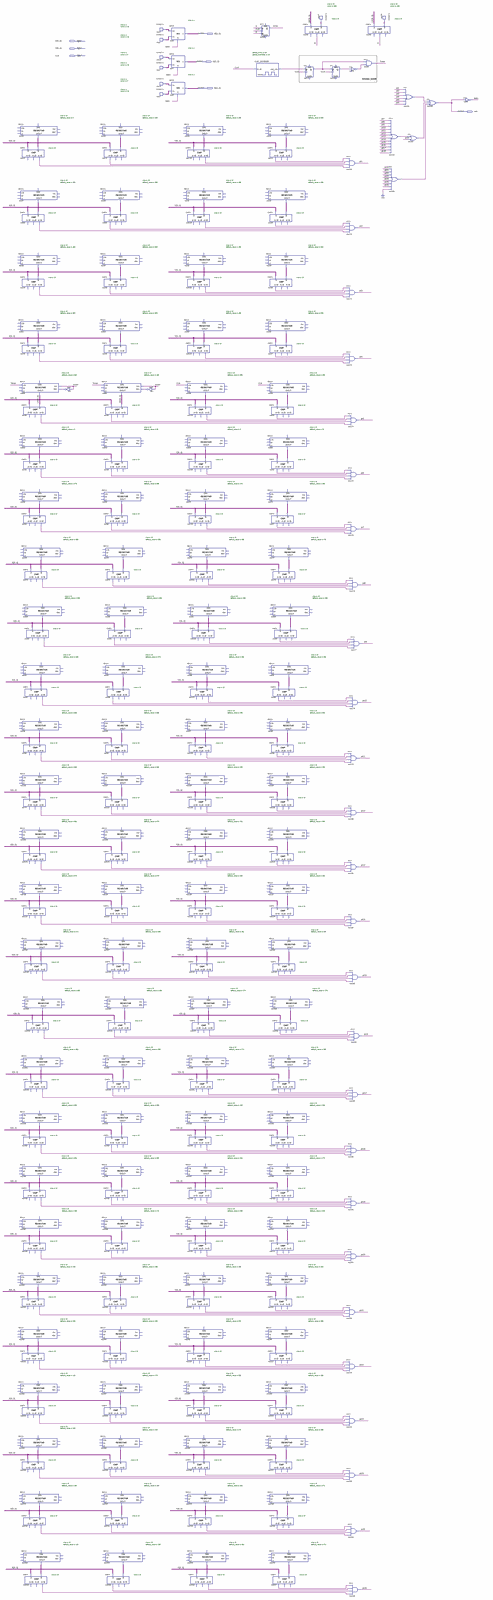
[diagram p0: schematic sheet, whole]
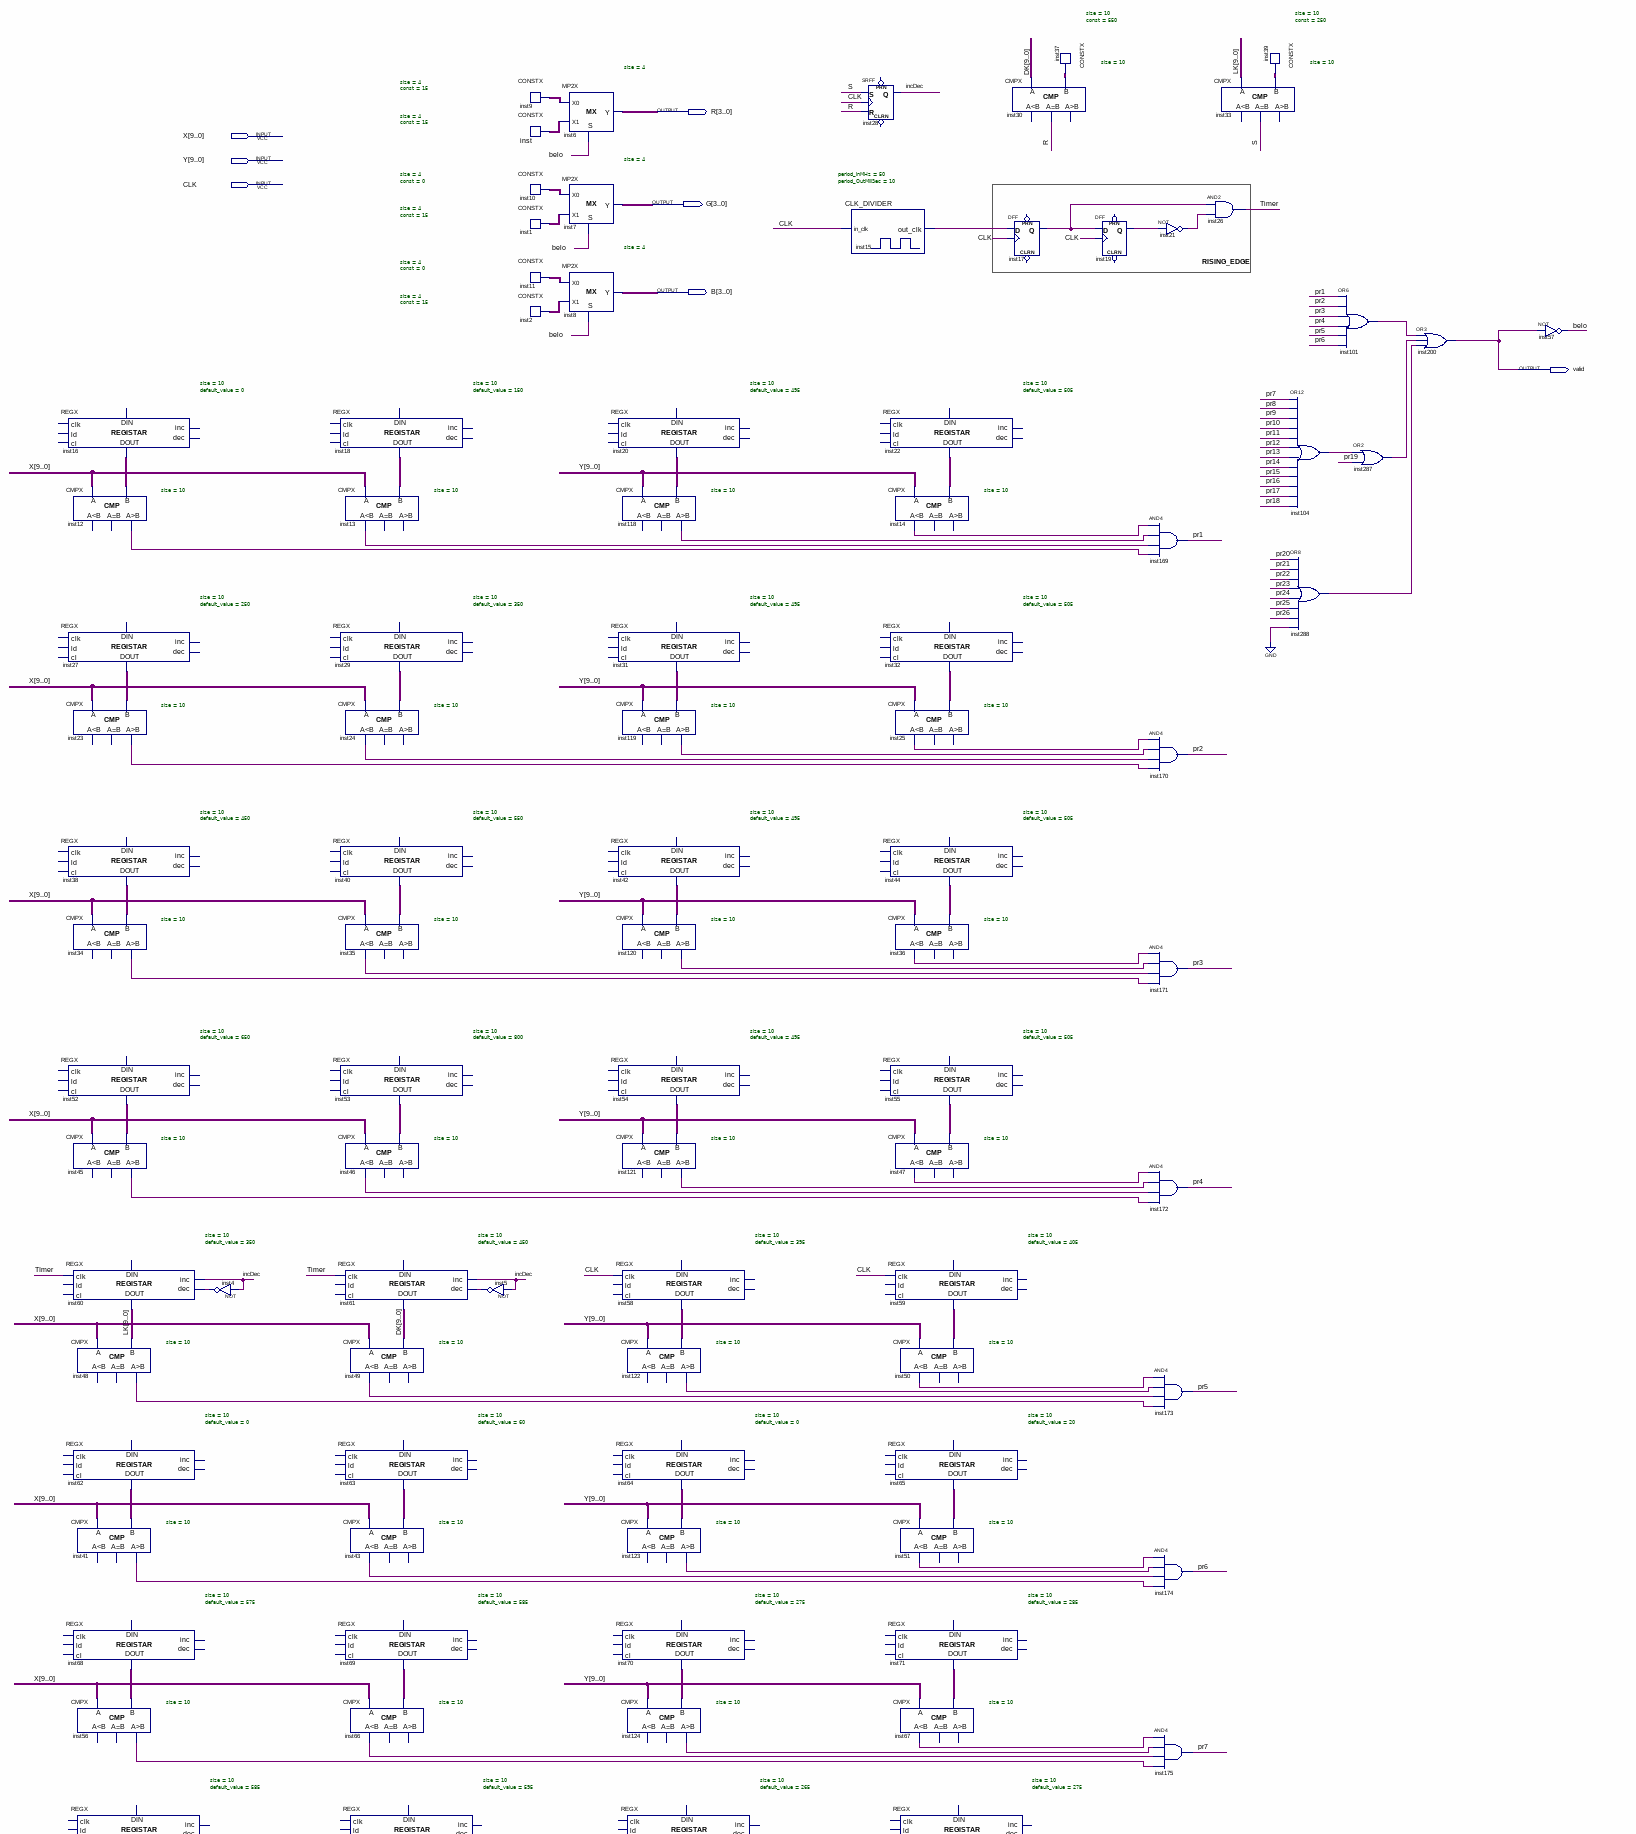
[diagram p1: schematic sheet, upper part]
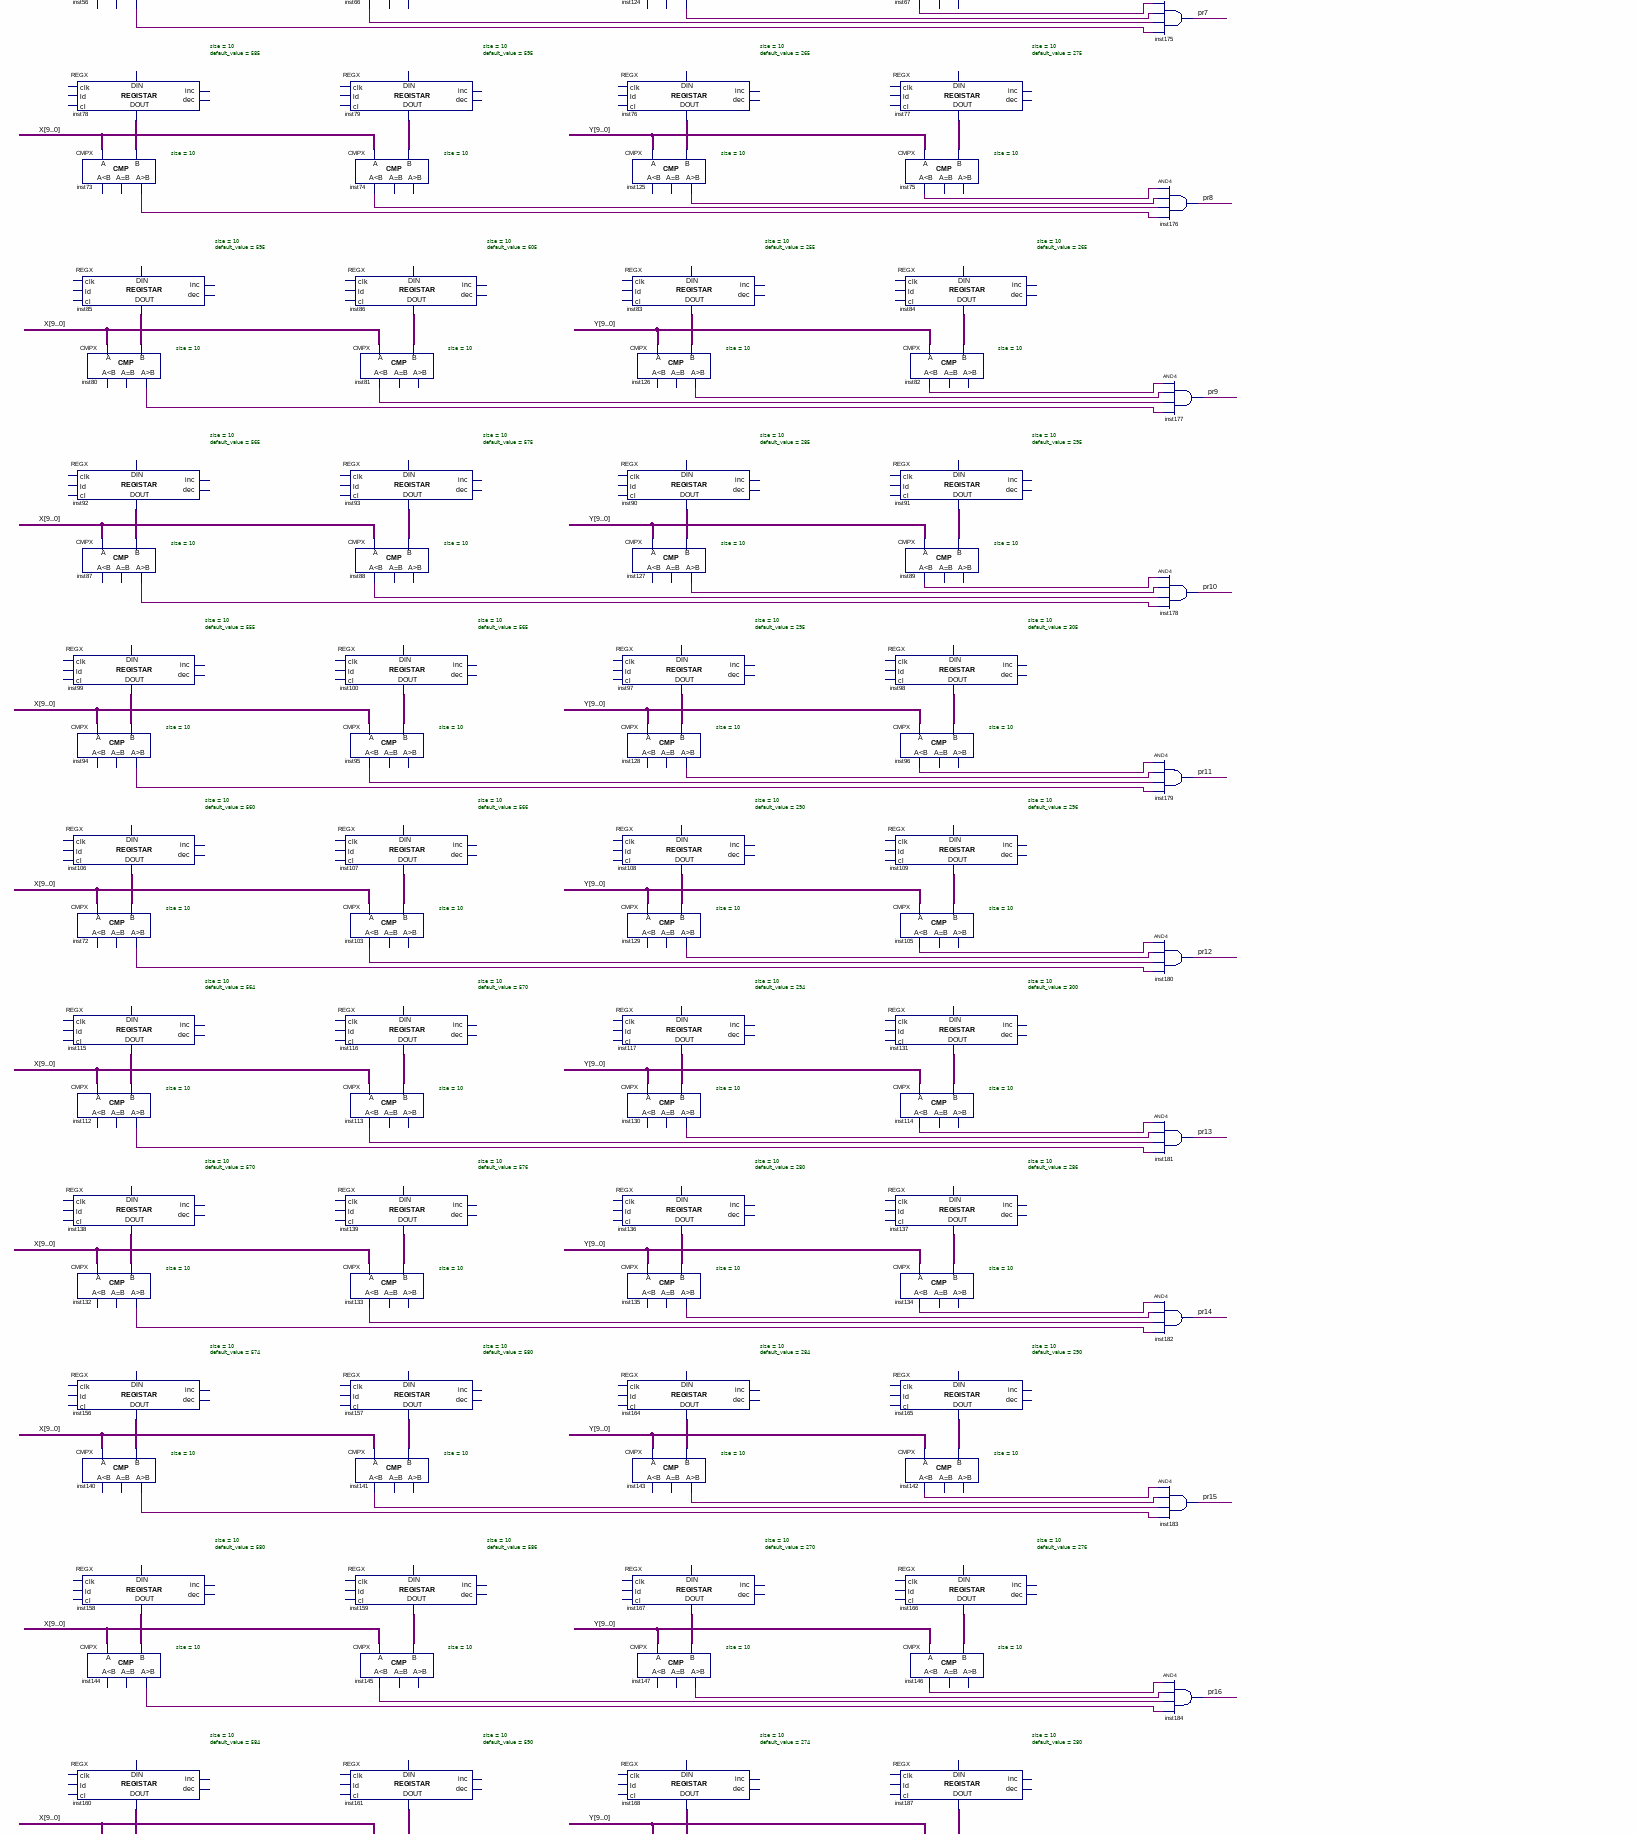
[diagram p2: schematic sheet, middle part]
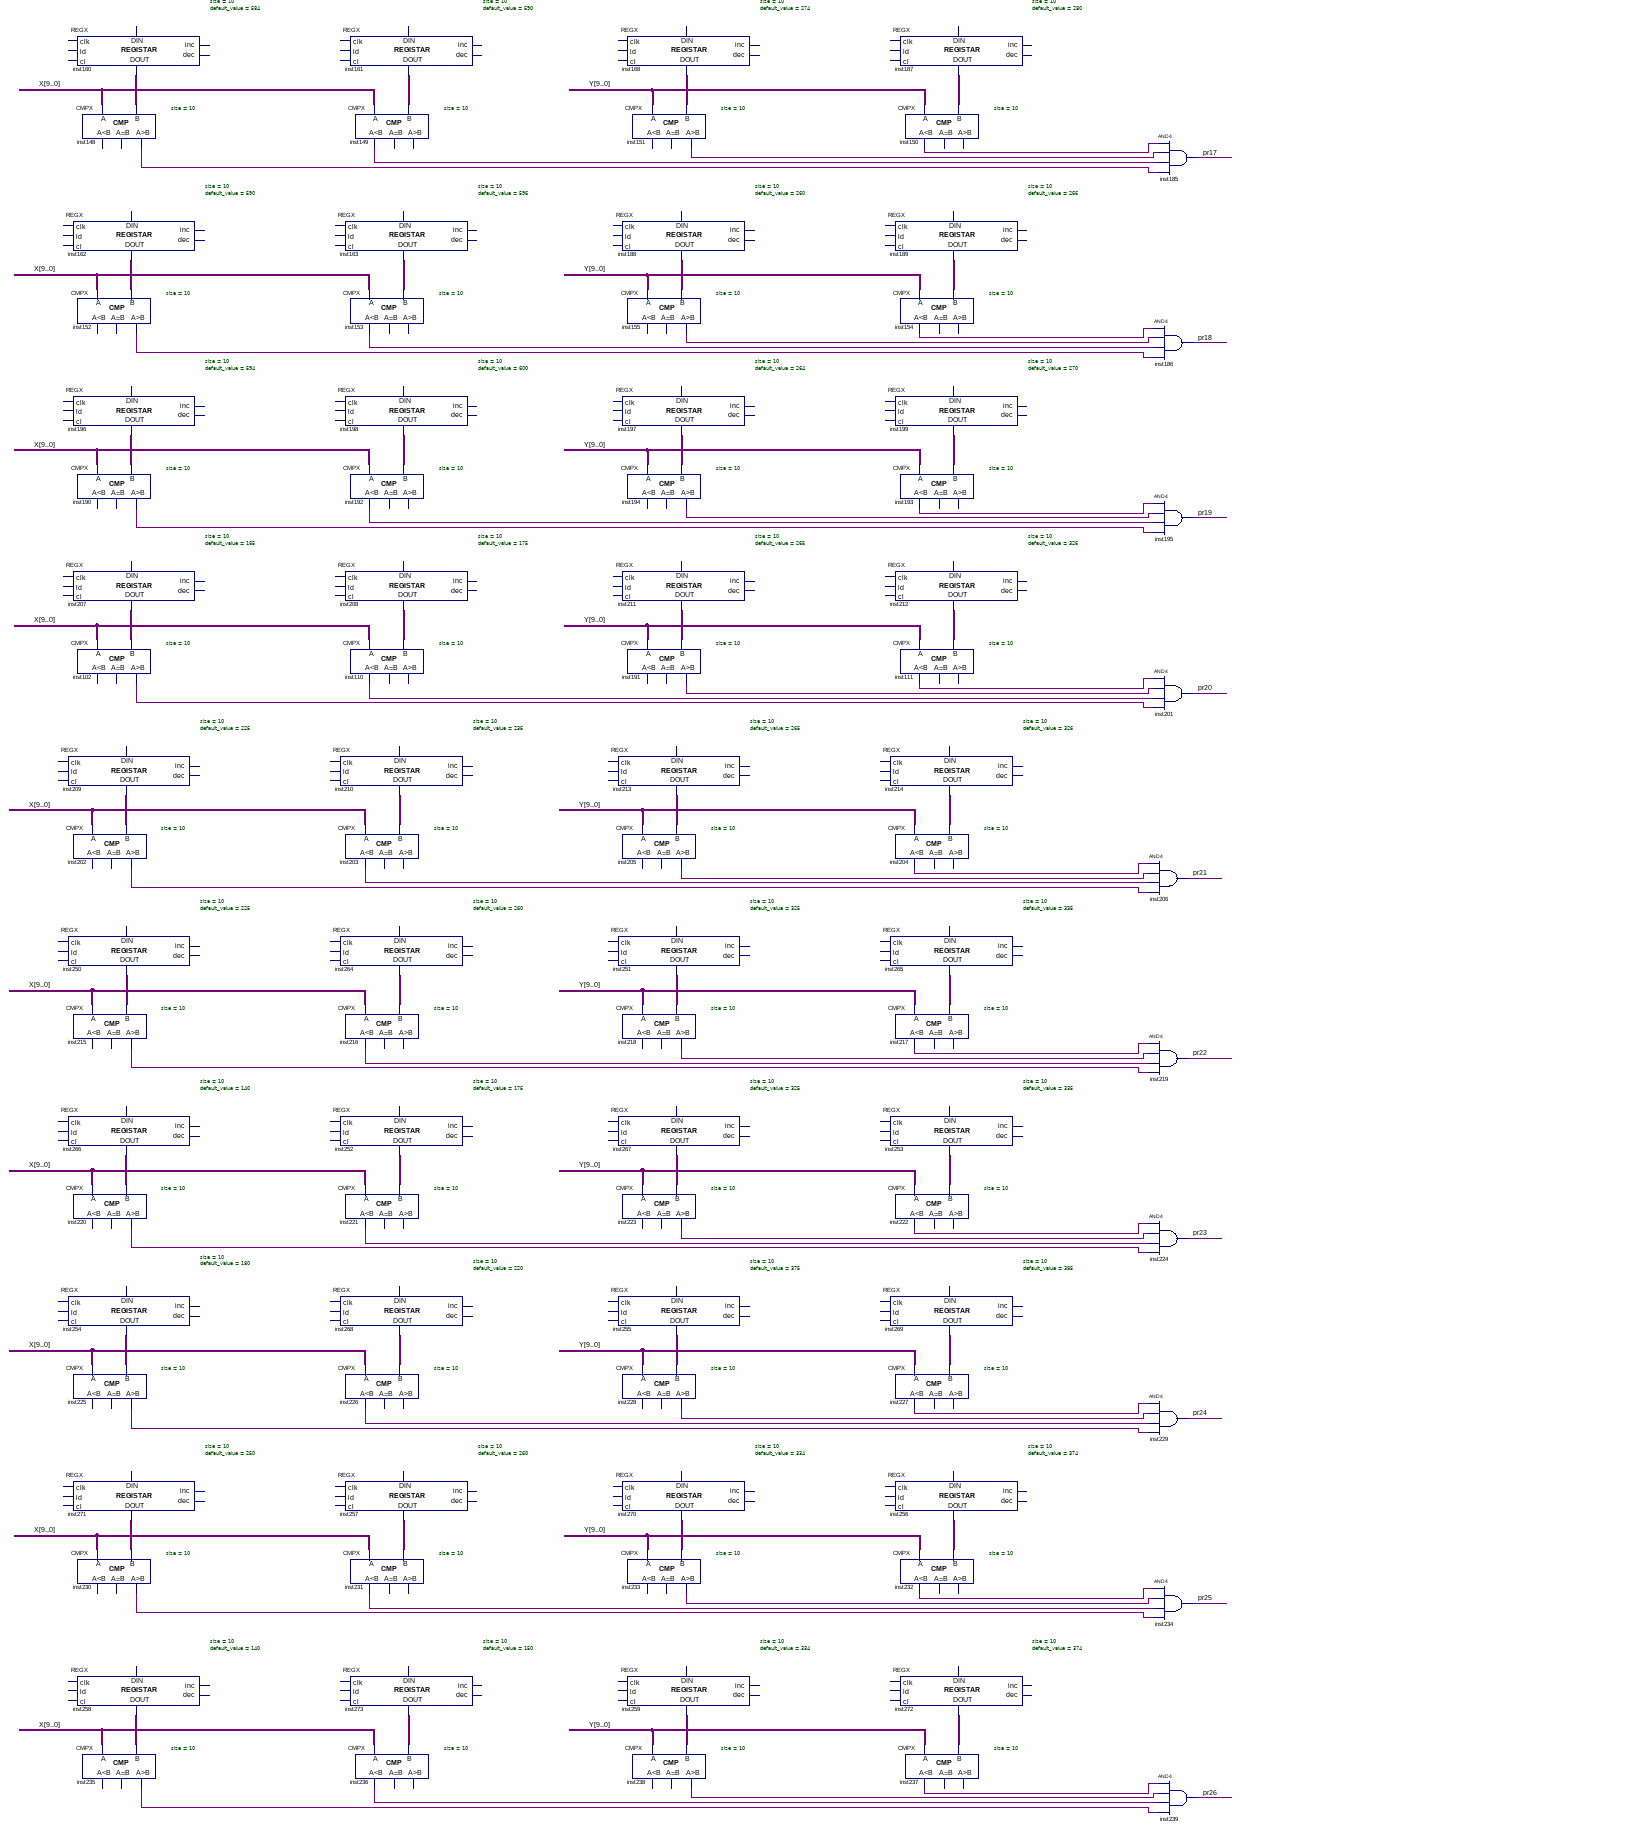
[diagram p3: schematic sheet, lower part]
// Quartus schematic Layer0.bdf as structural Verilog: 261 symbols, 7 pins
module Layer0 (
  input  [9:0] X,
  input  [9:0] Y,
  input  CLK,
  output [3:0] R,
  output [3:0] G,
  output [3:0] B,
  output valid
);

  wire belo, incDec, inst4_out, inst5_out, inst12_gr, inst13_ls, inst14_ls, inst15_out_clk, inst17_q,
       inst19_q, inst21_out, inst23_gr, inst24_ls, inst25_ls, inst34_gr, inst35_ls, inst36_ls, inst41_gr,
       inst43_ls, inst45_gr, inst46_ls, inst47_ls, inst48_gr, inst49_ls, inst50_ls, inst51_ls, inst56_gr,
       inst66_ls, inst67_ls, inst72_gr, inst73_gr, inst74_ls, inst75_ls, inst80_gr, inst81_ls, inst82_ls,
       inst87_gr, inst88_ls, inst89_ls, inst94_gr, inst95_ls, inst96_ls, inst101_out, inst102_gr, inst103_ls,
       inst104_out, inst105_ls, inst110_ls, inst111_ls, inst112_gr, inst113_ls, inst114_ls, inst118_gr,
       inst119_gr, inst120_gr, inst121_gr, inst122_gr, inst123_gr, inst124_gr, inst125_gr, inst126_gr,
       inst127_gr, inst128_gr, inst129_gr, inst130_gr, inst132_gr, inst133_ls, inst134_ls, inst135_gr,
       inst140_gr, inst141_ls, inst142_ls, inst143_gr, inst144_gr, inst145_ls, inst146_ls, inst147_gr,
       inst148_gr, inst149_ls, inst150_ls, inst151_gr, inst152_gr, inst153_ls, inst154_ls, inst155_gr,
       inst190_gr, inst191_gr, inst192_ls, inst193_ls, inst194_gr, inst202_gr, inst203_ls, inst204_ls,
       inst205_gr, inst215_gr, inst216_ls, inst217_ls, inst218_gr, inst220_gr, inst221_ls, inst222_ls,
       inst223_gr, inst225_gr, inst226_ls, inst227_ls, inst228_gr, inst230_gr, inst231_ls, inst232_ls,
       inst233_gr, inst235_gr, inst236_ls, inst237_ls, inst238_gr, inst287_out, inst288_out, pr1, pr2, pr3,
       pr4, pr5, pr6, pr7, pr8, pr9, pr10, pr11, pr12, pr13, pr14, pr15, pr16, pr17, pr18, pr19, pr20, pr21,
       pr22, pr23, pr24, pr25, pr26, R_1bit, S, Timer;
  wire [3:0] inst1_data, inst2_data, inst9_data, inst10_data, inst11_data, inst_data;
  wire [9:0] DK, inst16_data_out, inst18_data_out, inst20_data_out, inst22_data_out, inst27_data_out,
       inst29_data_out, inst31_data_out, inst32_data_out, inst37_data, inst38_data_out, inst39_data,
       inst40_data_out, inst42_data_out, inst44_data_out, inst52_data_out, inst53_data_out, inst54_data_out,
       inst55_data_out, inst58_data_out, inst59_data_out, inst62_data_out, inst63_data_out, inst64_data_out,
       inst65_data_out, inst68_data_out, inst69_data_out, inst70_data_out, inst71_data_out, inst76_data_out,
       inst77_data_out, inst78_data_out, inst79_data_out, inst83_data_out, inst84_data_out, inst85_data_out,
       inst86_data_out, inst90_data_out, inst91_data_out, inst92_data_out, inst93_data_out, inst97_data_out,
       inst98_data_out, inst99_data_out, inst100_data_out, inst106_data_out, inst107_data_out,
       inst108_data_out, inst109_data_out, inst115_data_out, inst116_data_out, inst117_data_out,
       inst131_data_out, inst136_data_out, inst137_data_out, inst138_data_out, inst139_data_out,
       inst156_data_out, inst157_data_out, inst158_data_out, inst159_data_out, inst160_data_out,
       inst161_data_out, inst162_data_out, inst163_data_out, inst164_data_out, inst165_data_out,
       inst166_data_out, inst167_data_out, inst168_data_out, inst187_data_out, inst188_data_out,
       inst189_data_out, inst196_data_out, inst197_data_out, inst198_data_out, inst199_data_out,
       inst207_data_out, inst208_data_out, inst209_data_out, inst210_data_out, inst211_data_out,
       inst212_data_out, inst213_data_out, inst214_data_out, inst250_data_out, inst251_data_out,
       inst252_data_out, inst253_data_out, inst254_data_out, inst255_data_out, inst256_data_out,
       inst257_data_out, inst258_data_out, inst259_data_out, inst264_data_out, inst265_data_out,
       inst266_data_out, inst267_data_out, inst268_data_out, inst269_data_out, inst270_data_out,
       inst271_data_out, inst272_data_out, inst273_data_out, LK;

  REGX #(.size(10), .default_value(0)) inst16 (.data_out(inst16_data_out));  // open: clk, ld, cl, inc, dec, data_in
  CMPX #(.size(10)) inst12 (.A(X), .B(inst16_data_out), .gr(inst12_gr));  // open: ls, eq
  REGX #(.size(10), .default_value(250)) inst27 (.data_out(inst27_data_out));  // open: clk, ld, cl, inc, dec, data_in
  CMPX #(.size(10)) inst23 (.A(X), .B(inst27_data_out), .gr(inst23_gr));  // open: ls, eq
  REGX #(.size(10), .default_value(450)) inst38 (.data_out(inst38_data_out));  // open: clk, ld, cl, inc, dec, data_in
  CMPX #(.size(10)) inst34 (.A(X), .B(inst38_data_out), .gr(inst34_gr));  // open: ls, eq
  REGX #(.size(10), .default_value(650)) inst52 (.data_out(inst52_data_out));  // open: clk, ld, cl, inc, dec, data_in
  CMPX #(.size(10)) inst45 (.A(X), .B(inst52_data_out), .gr(inst45_gr));  // open: ls, eq
  REGX #(.size(10), .default_value(350)) inst60 (
    .clk(Timer), .inc(incDec), .dec(inst4_out), .data_out(LK));  // open: ld, cl, data_in
  REGX #(.size(10), .default_value(0)) inst62 (.data_out(inst62_data_out));  // open: clk, ld, cl, inc, dec, data_in
  REGX #(.size(10), .default_value(575)) inst68 (.data_out(inst68_data_out));  // open: clk, ld, cl, inc, dec, data_in
  REGX #(.size(10), .default_value(555)) inst99 (.data_out(inst99_data_out));  // open: clk, ld, cl, inc, dec, data_in
  REGX #(.size(10), .default_value(560)) inst106 (.data_out(inst106_data_out));  // open: clk, ld, cl, inc, dec, data_in
  REGX #(.size(10), .default_value(564)) inst115 (.data_out(inst115_data_out));  // open: clk, ld, cl, inc, dec, data_in
  REGX #(.size(10), .default_value(570)) inst138 (.data_out(inst138_data_out));  // open: clk, ld, cl, inc, dec, data_in
  REGX #(.size(10), .default_value(590)) inst162 (.data_out(inst162_data_out));  // open: clk, ld, cl, inc, dec, data_in
  REGX #(.size(10), .default_value(594)) inst196 (.data_out(inst196_data_out));  // open: clk, ld, cl, inc, dec, data_in
  REGX #(.size(10), .default_value(165)) inst207 (.data_out(inst207_data_out));  // open: clk, ld, cl, inc, dec, data_in
  REGX #(.size(10), .default_value(225)) inst209 (.data_out(inst209_data_out));  // open: clk, ld, cl, inc, dec, data_in
  CMPX #(.size(10)) inst202 (.A(X), .B(inst209_data_out), .gr(inst202_gr));  // open: ls, eq
  REGX #(.size(10), .default_value(225)) inst250 (.data_out(inst250_data_out));  // open: clk, ld, cl, inc, dec, data_in
  CMPX #(.size(10)) inst215 (.A(X), .B(inst250_data_out), .gr(inst215_gr));  // open: ls, eq
  REGX #(.size(10), .default_value(140)) inst266 (.data_out(inst266_data_out));  // open: clk, ld, cl, inc, dec, data_in
  CMPX #(.size(10)) inst220 (.A(X), .B(inst266_data_out), .gr(inst220_gr));  // open: ls, eq
  REGX #(.size(10), .default_value(180)) inst254 (.data_out(inst254_data_out));  // open: clk, ld, cl, inc, dec, data_in
  CMPX #(.size(10)) inst225 (.A(X), .B(inst254_data_out), .gr(inst225_gr));  // open: ls, eq
  REGX #(.size(10), .default_value(250)) inst271 (.data_out(inst271_data_out));  // open: clk, ld, cl, inc, dec, data_in
  CMPX #(.size(10)) inst48 (.A(X), .B(LK), .gr(inst48_gr));  // open: ls, eq
  CMPX #(.size(10)) inst41 (.A(X), .B(inst62_data_out), .gr(inst41_gr));  // open: ls, eq
  CMPX #(.size(10)) inst56 (.A(X), .B(inst68_data_out), .gr(inst56_gr));  // open: ls, eq
  REGX #(.size(10), .default_value(585)) inst78 (.data_out(inst78_data_out));  // open: clk, ld, cl, inc, dec, data_in
  CMPX #(.size(10)) inst73 (.A(X), .B(inst78_data_out), .gr(inst73_gr));  // open: ls, eq
  REGX #(.size(10), .default_value(595)) inst85 (.data_out(inst85_data_out));  // open: clk, ld, cl, inc, dec, data_in
  CMPX #(.size(10)) inst80 (.A(X), .B(inst85_data_out), .gr(inst80_gr));  // open: ls, eq
  REGX #(.size(10), .default_value(565)) inst92 (.data_out(inst92_data_out));  // open: clk, ld, cl, inc, dec, data_in
  CMPX #(.size(10)) inst87 (.A(X), .B(inst92_data_out), .gr(inst87_gr));  // open: ls, eq
  CMPX #(.size(10)) inst94 (.A(X), .B(inst99_data_out), .gr(inst94_gr));  // open: ls, eq
  CMPX #(.size(10)) inst72 (.A(X), .B(inst106_data_out), .gr(inst72_gr));  // open: ls, eq
  CMPX #(.size(10)) inst112 (.A(X), .B(inst115_data_out), .gr(inst112_gr));  // open: ls, eq
  CMPX #(.size(10)) inst132 (.A(X), .B(inst138_data_out), .gr(inst132_gr));  // open: ls, eq
  REGX #(.size(10), .default_value(574)) inst156 (.data_out(inst156_data_out));  // open: clk, ld, cl, inc, dec, data_in
  CMPX #(.size(10)) inst140 (.A(X), .B(inst156_data_out), .gr(inst140_gr));  // open: ls, eq
  REGX #(.size(10), .default_value(580)) inst158 (.data_out(inst158_data_out));  // open: clk, ld, cl, inc, dec, data_in
  CMPX #(.size(10)) inst144 (.A(X), .B(inst158_data_out), .gr(inst144_gr));  // open: ls, eq
  REGX #(.size(10), .default_value(584)) inst160 (.data_out(inst160_data_out));  // open: clk, ld, cl, inc, dec, data_in
  CMPX #(.size(10)) inst148 (.A(X), .B(inst160_data_out), .gr(inst148_gr));  // open: ls, eq
  CMPX #(.size(10)) inst152 (.A(X), .B(inst162_data_out), .gr(inst152_gr));  // open: ls, eq
  CMPX #(.size(10)) inst190 (.A(X), .B(inst196_data_out), .gr(inst190_gr));  // open: ls, eq
  CMPX #(.size(10)) inst102 (.A(X), .B(inst207_data_out), .gr(inst102_gr));  // open: ls, eq
  CMPX #(.size(10)) inst230 (.A(X), .B(inst271_data_out), .gr(inst230_gr));  // open: ls, eq
  REGX #(.size(10), .default_value(140)) inst258 (.data_out(inst258_data_out));  // open: clk, ld, cl, inc, dec, data_in
  CMPX #(.size(10)) inst235 (.A(X), .B(inst258_data_out), .gr(inst235_gr));  // open: ls, eq
  not inst4 (inst4_out, incDec);
  REGX #(.size(10), .default_value(150)) inst18 (.data_out(inst18_data_out));  // open: clk, ld, cl, inc, dec, data_in
  CMPX #(.size(10)) inst13 (.A(X), .B(inst18_data_out), .ls(inst13_ls));  // open: eq, gr
  REGX #(.size(10), .default_value(350)) inst29 (.data_out(inst29_data_out));  // open: clk, ld, cl, inc, dec, data_in
  CMPX #(.size(10)) inst24 (.A(X), .B(inst29_data_out), .ls(inst24_ls));  // open: eq, gr
  REGX #(.size(10), .default_value(550)) inst40 (.data_out(inst40_data_out));  // open: clk, ld, cl, inc, dec, data_in
  CMPX #(.size(10)) inst35 (.A(X), .B(inst40_data_out), .ls(inst35_ls));  // open: eq, gr
  REGX #(.size(10), .default_value(800)) inst53 (.data_out(inst53_data_out));  // open: clk, ld, cl, inc, dec, data_in
  CMPX #(.size(10)) inst46 (.A(X), .B(inst53_data_out), .ls(inst46_ls));  // open: eq, gr
  REGX #(.size(10), .default_value(450)) inst61 (
    .clk(Timer), .inc(incDec), .dec(inst5_out), .data_out(DK));  // open: ld, cl, data_in
  REGX #(.size(10), .default_value(60)) inst63 (.data_out(inst63_data_out));  // open: clk, ld, cl, inc, dec, data_in
  REGX #(.size(10), .default_value(585)) inst69 (.data_out(inst69_data_out));  // open: clk, ld, cl, inc, dec, data_in
  REGX #(.size(10), .default_value(565)) inst100 (.data_out(inst100_data_out));  // open: clk, ld, cl, inc, dec, data_in
  REGX #(.size(10), .default_value(566)) inst107 (.data_out(inst107_data_out));  // open: clk, ld, cl, inc, dec, data_in
  REGX #(.size(10), .default_value(570)) inst116 (.data_out(inst116_data_out));  // open: clk, ld, cl, inc, dec, data_in
  REGX #(.size(10), .default_value(576)) inst139 (.data_out(inst139_data_out));  // open: clk, ld, cl, inc, dec, data_in
  REGX #(.size(10), .default_value(596)) inst163 (.data_out(inst163_data_out));  // open: clk, ld, cl, inc, dec, data_in
  REGX #(.size(10), .default_value(600)) inst198 (.data_out(inst198_data_out));  // open: clk, ld, cl, inc, dec, data_in
  REGX #(.size(10), .default_value(175)) inst208 (.data_out(inst208_data_out));  // open: clk, ld, cl, inc, dec, data_in
  REGX #(.size(10), .default_value(235)) inst210 (.data_out(inst210_data_out));  // open: clk, ld, cl, inc, dec, data_in
  CMPX #(.size(10)) inst203 (.A(X), .B(inst210_data_out), .ls(inst203_ls));  // open: eq, gr
  REGX #(.size(10), .default_value(260)) inst264 (.data_out(inst264_data_out));  // open: clk, ld, cl, inc, dec, data_in
  CMPX #(.size(10)) inst216 (.A(X), .B(inst264_data_out), .ls(inst216_ls));  // open: eq, gr
  REGX #(.size(10), .default_value(175)) inst252 (.data_out(inst252_data_out));  // open: clk, ld, cl, inc, dec, data_in
  CMPX #(.size(10)) inst221 (.A(X), .B(inst252_data_out), .ls(inst221_ls));  // open: eq, gr
  REGX #(.size(10), .default_value(220)) inst268 (.data_out(inst268_data_out));  // open: clk, ld, cl, inc, dec, data_in
  CMPX #(.size(10)) inst226 (.A(X), .B(inst268_data_out), .ls(inst226_ls));  // open: eq, gr
  REGX #(.size(10), .default_value(260)) inst257 (.data_out(inst257_data_out));  // open: clk, ld, cl, inc, dec, data_in
  CMPX #(.size(10)) inst49 (.A(X), .B(DK), .ls(inst49_ls));  // open: eq, gr
  CMPX #(.size(10)) inst43 (.A(X), .B(inst63_data_out), .ls(inst43_ls));  // open: eq, gr
  CMPX #(.size(10)) inst66 (.A(X), .B(inst69_data_out), .ls(inst66_ls));  // open: eq, gr
  REGX #(.size(10), .default_value(595)) inst79 (.data_out(inst79_data_out));  // open: clk, ld, cl, inc, dec, data_in
  CMPX #(.size(10)) inst74 (.A(X), .B(inst79_data_out), .ls(inst74_ls));  // open: eq, gr
  REGX #(.size(10), .default_value(605)) inst86 (.data_out(inst86_data_out));  // open: clk, ld, cl, inc, dec, data_in
  CMPX #(.size(10)) inst81 (.A(X), .B(inst86_data_out), .ls(inst81_ls));  // open: eq, gr
  REGX #(.size(10), .default_value(575)) inst93 (.data_out(inst93_data_out));  // open: clk, ld, cl, inc, dec, data_in
  CMPX #(.size(10)) inst88 (.A(X), .B(inst93_data_out), .ls(inst88_ls));  // open: eq, gr
  CMPX #(.size(10)) inst95 (.A(X), .B(inst100_data_out), .ls(inst95_ls));  // open: eq, gr
  CMPX #(.size(10)) inst103 (.A(X), .B(inst107_data_out), .ls(inst103_ls));  // open: eq, gr
  CMPX #(.size(10)) inst113 (.A(X), .B(inst116_data_out), .ls(inst113_ls));  // open: eq, gr
  CMPX #(.size(10)) inst133 (.A(X), .B(inst139_data_out), .ls(inst133_ls));  // open: eq, gr
  REGX #(.size(10), .default_value(580)) inst157 (.data_out(inst157_data_out));  // open: clk, ld, cl, inc, dec, data_in
  CMPX #(.size(10)) inst141 (.A(X), .B(inst157_data_out), .ls(inst141_ls));  // open: eq, gr
  REGX #(.size(10), .default_value(586)) inst159 (.data_out(inst159_data_out));  // open: clk, ld, cl, inc, dec, data_in
  CMPX #(.size(10)) inst145 (.A(X), .B(inst159_data_out), .ls(inst145_ls));  // open: eq, gr
  REGX #(.size(10), .default_value(590)) inst161 (.data_out(inst161_data_out));  // open: clk, ld, cl, inc, dec, data_in
  CMPX #(.size(10)) inst149 (.A(X), .B(inst161_data_out), .ls(inst149_ls));  // open: eq, gr
  CMPX #(.size(10)) inst153 (.A(X), .B(inst163_data_out), .ls(inst153_ls));  // open: eq, gr
  CMPX #(.size(10)) inst192 (.A(X), .B(inst198_data_out), .ls(inst192_ls));  // open: eq, gr
  CMPX #(.size(10)) inst110 (.A(X), .B(inst208_data_out), .ls(inst110_ls));  // open: eq, gr
  CMPX #(.size(10)) inst231 (.A(X), .B(inst257_data_out), .ls(inst231_ls));  // open: eq, gr
  REGX #(.size(10), .default_value(150)) inst273 (.data_out(inst273_data_out));  // open: clk, ld, cl, inc, dec, data_in
  CMPX #(.size(10)) inst236 (.A(X), .B(inst273_data_out), .ls(inst236_ls));  // open: eq, gr
  not inst5 (inst5_out, incDec);
  CONSTX #(.size(4), .\const (15)) inst9 (.data(inst9_data));
  CONSTX #(.size(4), .\const (15)) inst (.data(inst_data));
  CONSTX #(.size(4), .\const (0)) inst10 (.data(inst10_data));
  CONSTX #(.size(4), .\const (15)) inst1 (.data(inst1_data));
  CONSTX #(.size(4), .\const (0)) inst11 (.data(inst11_data));
  CONSTX #(.size(4), .\const (15)) inst2 (.data(inst2_data));
  MP2X #(.size(4)) inst6 (.S(belo), .X0(inst9_data), .X1(inst_data), .Y(R));
  MP2X #(.size(4)) inst7 (.S(belo), .X0(inst10_data), .X1(inst1_data), .Y(G));
  MP2X #(.size(4)) inst8 (.S(belo), .X0(inst11_data), .X1(inst2_data), .Y(B));
  REGX #(.size(10), .default_value(495)) inst20 (.data_out(inst20_data_out));  // open: clk, ld, cl, inc, dec, data_in
  REGX #(.size(10), .default_value(495)) inst31 (.data_out(inst31_data_out));  // open: clk, ld, cl, inc, dec, data_in
  REGX #(.size(10), .default_value(495)) inst42 (.data_out(inst42_data_out));  // open: clk, ld, cl, inc, dec, data_in
  REGX #(.size(10), .default_value(495)) inst54 (.data_out(inst54_data_out));  // open: clk, ld, cl, inc, dec, data_in
  REGX #(.size(10), .default_value(265)) inst213 (.data_out(inst213_data_out));  // open: clk, ld, cl, inc, dec, data_in
  REGX #(.size(10), .default_value(325)) inst251 (.data_out(inst251_data_out));  // open: clk, ld, cl, inc, dec, data_in
  REGX #(.size(10), .default_value(325)) inst267 (.data_out(inst267_data_out));  // open: clk, ld, cl, inc, dec, data_in
  REGX #(.size(10), .default_value(375)) inst255 (.data_out(inst255_data_out));  // open: clk, ld, cl, inc, dec, data_in
  CMPX #(.size(10)) inst118 (.A(Y), .B(inst20_data_out), .gr(inst118_gr));  // open: ls, eq
  CMPX #(.size(10)) inst119 (.A(Y), .B(inst31_data_out), .gr(inst119_gr));  // open: ls, eq
  CMPX #(.size(10)) inst120 (.A(Y), .B(inst42_data_out), .gr(inst120_gr));  // open: ls, eq
  CMPX #(.size(10)) inst121 (.A(Y), .B(inst54_data_out), .gr(inst121_gr));  // open: ls, eq
  REGX #(.size(10), .default_value(395)) inst58 (
    .clk(CLK), .data_out(inst58_data_out));  // open: ld, cl, inc, dec, data_in
  CMPX #(.size(10)) inst122 (.A(Y), .B(inst58_data_out), .gr(inst122_gr));  // open: ls, eq
  REGX #(.size(10), .default_value(0)) inst64 (.data_out(inst64_data_out));  // open: clk, ld, cl, inc, dec, data_in
  CMPX #(.size(10)) inst123 (.A(Y), .B(inst64_data_out), .gr(inst123_gr));  // open: ls, eq
  REGX #(.size(10), .default_value(275)) inst70 (.data_out(inst70_data_out));  // open: clk, ld, cl, inc, dec, data_in
  CMPX #(.size(10)) inst124 (.A(Y), .B(inst70_data_out), .gr(inst124_gr));  // open: ls, eq
  REGX #(.size(10), .default_value(265)) inst76 (.data_out(inst76_data_out));  // open: clk, ld, cl, inc, dec, data_in
  CMPX #(.size(10)) inst125 (.A(Y), .B(inst76_data_out), .gr(inst125_gr));  // open: ls, eq
  REGX #(.size(10), .default_value(255)) inst83 (.data_out(inst83_data_out));  // open: clk, ld, cl, inc, dec, data_in
  CMPX #(.size(10)) inst126 (.A(Y), .B(inst83_data_out), .gr(inst126_gr));  // open: ls, eq
  REGX #(.size(10), .default_value(285)) inst90 (.data_out(inst90_data_out));  // open: clk, ld, cl, inc, dec, data_in
  CMPX #(.size(10)) inst127 (.A(Y), .B(inst90_data_out), .gr(inst127_gr));  // open: ls, eq
  REGX #(.size(10), .default_value(295)) inst97 (.data_out(inst97_data_out));  // open: clk, ld, cl, inc, dec, data_in
  CMPX #(.size(10)) inst128 (.A(Y), .B(inst97_data_out), .gr(inst128_gr));  // open: ls, eq
  REGX #(.size(10), .default_value(290)) inst108 (.data_out(inst108_data_out));  // open: clk, ld, cl, inc, dec, data_in
  CMPX #(.size(10)) inst129 (.A(Y), .B(inst108_data_out), .gr(inst129_gr));  // open: ls, eq
  REGX #(.size(10), .default_value(294)) inst117 (.data_out(inst117_data_out));  // open: clk, ld, cl, inc, dec, data_in
  CMPX #(.size(10)) inst130 (.A(Y), .B(inst117_data_out), .gr(inst130_gr));  // open: ls, eq
  REGX #(.size(10), .default_value(280)) inst136 (.data_out(inst136_data_out));  // open: clk, ld, cl, inc, dec, data_in
  CMPX #(.size(10)) inst135 (.A(Y), .B(inst136_data_out), .gr(inst135_gr));  // open: ls, eq
  REGX #(.size(10), .default_value(284)) inst164 (.data_out(inst164_data_out));  // open: clk, ld, cl, inc, dec, data_in
  CMPX #(.size(10)) inst143 (.A(Y), .B(inst164_data_out), .gr(inst143_gr));  // open: ls, eq
  REGX #(.size(10), .default_value(270)) inst167 (.data_out(inst167_data_out));  // open: clk, ld, cl, inc, dec, data_in
  CMPX #(.size(10)) inst147 (.A(Y), .B(inst167_data_out), .gr(inst147_gr));  // open: ls, eq
  REGX #(.size(10), .default_value(274)) inst168 (.data_out(inst168_data_out));  // open: clk, ld, cl, inc, dec, data_in
  CMPX #(.size(10)) inst151 (.A(Y), .B(inst168_data_out), .gr(inst151_gr));  // open: ls, eq
  REGX #(.size(10), .default_value(260)) inst188 (.data_out(inst188_data_out));  // open: clk, ld, cl, inc, dec, data_in
  CMPX #(.size(10)) inst155 (.A(Y), .B(inst188_data_out), .gr(inst155_gr));  // open: ls, eq
  REGX #(.size(10), .default_value(264)) inst197 (.data_out(inst197_data_out));  // open: clk, ld, cl, inc, dec, data_in
  CMPX #(.size(10)) inst194 (.A(Y), .B(inst197_data_out), .gr(inst194_gr));  // open: ls, eq
  REGX #(.size(10), .default_value(265)) inst211 (.data_out(inst211_data_out));  // open: clk, ld, cl, inc, dec, data_in
  CMPX #(.size(10)) inst191 (.A(Y), .B(inst211_data_out), .gr(inst191_gr));  // open: ls, eq
  CMPX #(.size(10)) inst205 (.A(Y), .B(inst213_data_out), .gr(inst205_gr));  // open: ls, eq
  CMPX #(.size(10)) inst218 (.A(Y), .B(inst251_data_out), .gr(inst218_gr));  // open: ls, eq
  CMPX #(.size(10)) inst223 (.A(Y), .B(inst267_data_out), .gr(inst223_gr));  // open: ls, eq
  CMPX #(.size(10)) inst228 (.A(Y), .B(inst255_data_out), .gr(inst228_gr));  // open: ls, eq
  REGX #(.size(10), .default_value(334)) inst270 (.data_out(inst270_data_out));  // open: clk, ld, cl, inc, dec, data_in
  CMPX #(.size(10)) inst233 (.A(Y), .B(inst270_data_out), .gr(inst233_gr));  // open: ls, eq
  REGX #(.size(10), .default_value(334)) inst259 (.data_out(inst259_data_out));  // open: clk, ld, cl, inc, dec, data_in
  CMPX #(.size(10)) inst238 (.A(Y), .B(inst259_data_out), .gr(inst238_gr));  // open: ls, eq
  CLK_DIVIDER #(.period_InMHz(50), .period_OutMiliSec(10)) inst15 (.in_clk(CLK), .out_clk(inst15_out_clk));
  SRFF inst28 (.S(S), .R(R_1bit), .CLK(CLK), .Q(incDec));  // open: PRN, CLRN
  REGX #(.size(10), .default_value(505)) inst22 (.data_out(inst22_data_out));  // open: clk, ld, cl, inc, dec, data_in
  REGX #(.size(10), .default_value(505)) inst32 (.data_out(inst32_data_out));  // open: clk, ld, cl, inc, dec, data_in
  REGX #(.size(10), .default_value(505)) inst44 (.data_out(inst44_data_out));  // open: clk, ld, cl, inc, dec, data_in
  REGX #(.size(10), .default_value(505)) inst55 (.data_out(inst55_data_out));  // open: clk, ld, cl, inc, dec, data_in
  REGX #(.size(10), .default_value(326)) inst214 (.data_out(inst214_data_out));  // open: clk, ld, cl, inc, dec, data_in
  REGX #(.size(10), .default_value(335)) inst265 (.data_out(inst265_data_out));  // open: clk, ld, cl, inc, dec, data_in
  REGX #(.size(10), .default_value(335)) inst253 (.data_out(inst253_data_out));  // open: clk, ld, cl, inc, dec, data_in
  REGX #(.size(10), .default_value(385)) inst269 (.data_out(inst269_data_out));  // open: clk, ld, cl, inc, dec, data_in
  CMPX #(.size(10)) inst14 (.A(Y), .B(inst22_data_out), .ls(inst14_ls));  // open: eq, gr
  CMPX #(.size(10)) inst25 (.A(Y), .B(inst32_data_out), .ls(inst25_ls));  // open: eq, gr
  CMPX #(.size(10)) inst36 (.A(Y), .B(inst44_data_out), .ls(inst36_ls));  // open: eq, gr
  CMPX #(.size(10)) inst47 (.A(Y), .B(inst55_data_out), .ls(inst47_ls));  // open: eq, gr
  REGX #(.size(10), .default_value(405)) inst59 (
    .clk(CLK), .data_out(inst59_data_out));  // open: ld, cl, inc, dec, data_in
  CMPX #(.size(10)) inst50 (.A(Y), .B(inst59_data_out), .ls(inst50_ls));  // open: eq, gr
  REGX #(.size(10), .default_value(20)) inst65 (.data_out(inst65_data_out));  // open: clk, ld, cl, inc, dec, data_in
  CMPX #(.size(10)) inst51 (.A(Y), .B(inst65_data_out), .ls(inst51_ls));  // open: eq, gr
  REGX #(.size(10), .default_value(285)) inst71 (.data_out(inst71_data_out));  // open: clk, ld, cl, inc, dec, data_in
  CMPX #(.size(10)) inst67 (.A(Y), .B(inst71_data_out), .ls(inst67_ls));  // open: eq, gr
  REGX #(.size(10), .default_value(275)) inst77 (.data_out(inst77_data_out));  // open: clk, ld, cl, inc, dec, data_in
  CMPX #(.size(10)) inst75 (.A(Y), .B(inst77_data_out), .ls(inst75_ls));  // open: eq, gr
  REGX #(.size(10), .default_value(265)) inst84 (.data_out(inst84_data_out));  // open: clk, ld, cl, inc, dec, data_in
  CMPX #(.size(10)) inst82 (.A(Y), .B(inst84_data_out), .ls(inst82_ls));  // open: eq, gr
  REGX #(.size(10), .default_value(295)) inst91 (.data_out(inst91_data_out));  // open: clk, ld, cl, inc, dec, data_in
  CMPX #(.size(10)) inst89 (.A(Y), .B(inst91_data_out), .ls(inst89_ls));  // open: eq, gr
  REGX #(.size(10), .default_value(305)) inst98 (.data_out(inst98_data_out));  // open: clk, ld, cl, inc, dec, data_in
  CMPX #(.size(10)) inst96 (.A(Y), .B(inst98_data_out), .ls(inst96_ls));  // open: eq, gr
  REGX #(.size(10), .default_value(296)) inst109 (.data_out(inst109_data_out));  // open: clk, ld, cl, inc, dec, data_in
  CMPX #(.size(10)) inst105 (.A(Y), .B(inst109_data_out), .ls(inst105_ls));  // open: eq, gr
  REGX #(.size(10), .default_value(300)) inst131 (.data_out(inst131_data_out));  // open: clk, ld, cl, inc, dec, data_in
  CMPX #(.size(10)) inst114 (.A(Y), .B(inst131_data_out), .ls(inst114_ls));  // open: eq, gr
  REGX #(.size(10), .default_value(286)) inst137 (.data_out(inst137_data_out));  // open: clk, ld, cl, inc, dec, data_in
  CMPX #(.size(10)) inst134 (.A(Y), .B(inst137_data_out), .ls(inst134_ls));  // open: eq, gr
  REGX #(.size(10), .default_value(290)) inst165 (.data_out(inst165_data_out));  // open: clk, ld, cl, inc, dec, data_in
  CMPX #(.size(10)) inst142 (.A(Y), .B(inst165_data_out), .ls(inst142_ls));  // open: eq, gr
  REGX #(.size(10), .default_value(276)) inst166 (.data_out(inst166_data_out));  // open: clk, ld, cl, inc, dec, data_in
  CMPX #(.size(10)) inst146 (.A(Y), .B(inst166_data_out), .ls(inst146_ls));  // open: eq, gr
  REGX #(.size(10), .default_value(280)) inst187 (.data_out(inst187_data_out));  // open: clk, ld, cl, inc, dec, data_in
  CMPX #(.size(10)) inst150 (.A(Y), .B(inst187_data_out), .ls(inst150_ls));  // open: eq, gr
  REGX #(.size(10), .default_value(266)) inst189 (.data_out(inst189_data_out));  // open: clk, ld, cl, inc, dec, data_in
  CMPX #(.size(10)) inst154 (.A(Y), .B(inst189_data_out), .ls(inst154_ls));  // open: eq, gr
  REGX #(.size(10), .default_value(270)) inst199 (.data_out(inst199_data_out));  // open: clk, ld, cl, inc, dec, data_in
  CMPX #(.size(10)) inst193 (.A(Y), .B(inst199_data_out), .ls(inst193_ls));  // open: eq, gr
  REGX #(.size(10), .default_value(326)) inst212 (.data_out(inst212_data_out));  // open: clk, ld, cl, inc, dec, data_in
  CMPX #(.size(10)) inst111 (.A(Y), .B(inst212_data_out), .ls(inst111_ls));  // open: eq, gr
  CMPX #(.size(10)) inst204 (.A(Y), .B(inst214_data_out), .ls(inst204_ls));  // open: eq, gr
  CMPX #(.size(10)) inst217 (.A(Y), .B(inst265_data_out), .ls(inst217_ls));  // open: eq, gr
  CMPX #(.size(10)) inst222 (.A(Y), .B(inst253_data_out), .ls(inst222_ls));  // open: eq, gr
  CMPX #(.size(10)) inst227 (.A(Y), .B(inst269_data_out), .ls(inst227_ls));  // open: eq, gr
  REGX #(.size(10), .default_value(374)) inst256 (.data_out(inst256_data_out));  // open: clk, ld, cl, inc, dec, data_in
  CMPX #(.size(10)) inst232 (.A(Y), .B(inst256_data_out), .ls(inst232_ls));  // open: eq, gr
  REGX #(.size(10), .default_value(374)) inst272 (.data_out(inst272_data_out));  // open: clk, ld, cl, inc, dec, data_in
  CMPX #(.size(10)) inst237 (.A(Y), .B(inst272_data_out), .ls(inst237_ls));  // open: eq, gr
  CMPX #(.size(10)) inst30 (.A(DK), .B(inst37_data), .eq(R_1bit));  // open: ls, gr
  DFF inst17 (.CLK(CLK), .D(inst15_out_clk), .Q(inst17_q));  // open: CLRN, PRN
  CONSTX #(.size(10), .\const (550)) inst37 (.data(inst37_data));
  DFF inst19 (.CLK(CLK), .D(inst17_q), .Q(inst19_q));  // open: CLRN, PRN
  and inst169 (pr1, inst14_ls, inst118_gr, inst13_ls, inst12_gr);
  and inst170 (pr2, inst25_ls, inst119_gr, inst24_ls, inst23_gr);
  and inst171 (pr3, inst36_ls, inst120_gr, inst35_ls, inst34_gr);
  and inst172 (pr4, inst47_ls, inst121_gr, inst46_ls, inst45_gr);
  and inst173 (pr5, inst50_ls, inst122_gr, inst49_ls, inst48_gr);
  and inst174 (pr6, inst51_ls, inst123_gr, inst43_ls, inst41_gr);
  and inst175 (pr7, inst67_ls, inst124_gr, inst66_ls, inst56_gr);
  and inst179 (pr11, inst96_ls, inst128_gr, inst95_ls, inst94_gr);
  and inst180 (pr12, inst105_ls, inst129_gr, inst103_ls, inst72_gr);
  and inst181 (pr13, inst114_ls, inst130_gr, inst113_ls, inst112_gr);
  and inst182 (pr14, inst134_ls, inst135_gr, inst133_ls, inst132_gr);
  and inst186 (pr18, inst154_ls, inst155_gr, inst153_ls, inst152_gr);
  and inst195 (pr19, inst193_ls, inst194_gr, inst192_ls, inst190_gr);
  and inst201 (pr20, inst111_ls, inst191_gr, inst110_ls, inst102_gr);
  and inst206 (pr21, inst204_ls, inst205_gr, inst203_ls, inst202_gr);
  and inst219 (pr22, inst217_ls, inst218_gr, inst216_ls, inst215_gr);
  and inst224 (pr23, inst222_ls, inst223_gr, inst221_ls, inst220_gr);
  and inst229 (pr24, inst227_ls, inst228_gr, inst226_ls, inst225_gr);
  and inst234 (pr25, inst232_ls, inst233_gr, inst231_ls, inst230_gr);
  not inst21 (inst21_out, inst19_q);
  and inst176 (pr8, inst75_ls, inst125_gr, inst74_ls, inst73_gr);
  and inst177 (pr9, inst82_ls, inst126_gr, inst81_ls, inst80_gr);
  and inst178 (pr10, inst89_ls, inst127_gr, inst88_ls, inst87_gr);
  and inst183 (pr15, inst142_ls, inst143_gr, inst141_ls, inst140_gr);
  and inst184 (pr16, inst146_ls, inst147_gr, inst145_ls, inst144_gr);
  and inst185 (pr17, inst150_ls, inst151_gr, inst149_ls, inst148_gr);
  and inst239 (pr26, inst237_ls, inst238_gr, inst236_ls, inst235_gr);
  CMPX #(.size(10)) inst33 (.A(LK), .B(inst39_data), .eq(S));  // open: ls, gr
  and inst26 (Timer, inst17_q, inst21_out);
  CONSTX #(.size(10), .\const (250)) inst39 (.data(inst39_data));
  or inst104 (inst104_out, pr7, pr8, pr9, pr10, pr11, pr12, pr13, pr14, pr15, pr16, pr17, pr18);
  or inst288 (inst288_out, pr20, pr21, pr22, pr23, pr24, pr25, pr26, 1'b0);
  or inst101 (inst101_out, pr1, pr2, pr3, pr4, pr5, pr6);
  or inst287 (inst287_out, inst104_out, pr19);
  or inst200 (valid, inst101_out, inst287_out, inst288_out);
  not inst57 (belo, valid);

  // Notes on the sheet:
  //   RISING_EDGE
endmodule
